# Altium schematic sheet SHDN-IMD-S06-V00-PSU.SchDoc: Power Supply
size A3; DrawnBy: Jonn Dillon; DocumentNumber: 4; Revision: 00; SheetNumber: 4; SheetTotal: 6; Version: 01; Project: IMD Daughter Board 2020; PageSetup: Record=PageOptions|CenterHorizontal=True|CenterVertical=True|PrintScale=0.97|XCorrection=1.00|YCorrection=1.00|PrintKind=0|BorderSize=5000000|LeftOffset=0|BottomOffset=0|Orientation=2|PaperLength=1000|PaperWidth=1000|Scale=100|PaperSource=7|PrintQuality=-4|MediaType=1|DitherType=10|PaperKind=A4|PrintScaleMode=1
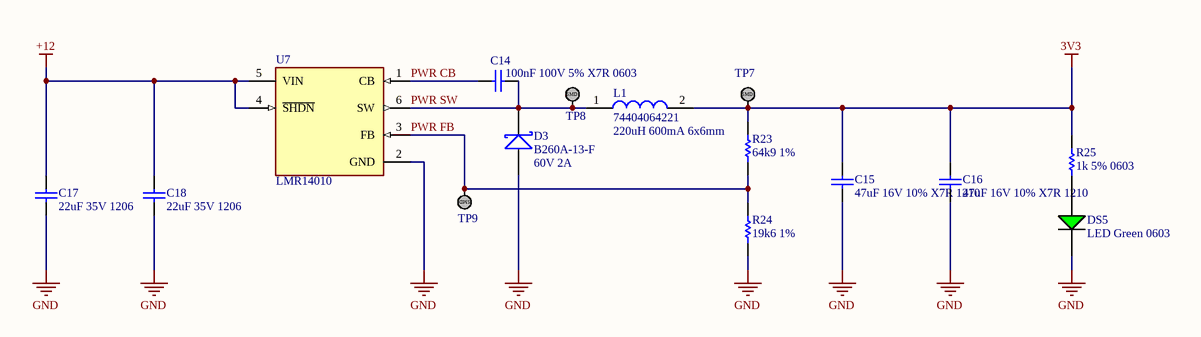
[diagram p0: SHDN-IMD-S06-V00-PSU.SchDoc]

## Parts
C14  100nF 100V 5% X7R 0603  [Cap_Ceramic_0603]
C15  47uF 16V 10% X7R 1210  [Cap_Ceramic_1210]
C16  47uF 16V 10% X7R 1210  [Cap_Ceramic_1210]
C17  22uF 35V 1206  [Cap_Ceramic_1206]
C18  22uF 35V 1206  [Cap_Ceramic_1206]
D3  B260A-13-F  [SMA]
DS5  LED Green 0603  [LED GREEN 0603]
L1  74404064221  [Inductor_6x6mm]
R23  64k9 1%  [Res_ThinFilm_0603]
R24  19k6 1%  [Res_ThinFilm_0603]
R25  1k 5% 0603  [Res_ThinFilm_0603]
TP7  TestPoint_SMD  [TestPointSMD]  (value not drawn)
TP8  TestPoint_SMD  [TestPointSMD]  (value not drawn)
TP9  TestPoint_SMD  [TestPointSMD]  (value not drawn)
U7  LMR14010  [LMR14010]

## Nets
3V3: C15.2 C16.2 L1.2 R23.2 R25.2 TP7.1
+12: C17.2 C18.2 U7.4(~{SHDN}) U7.5(VIN)
GND: C15.1 C16.1 C17.1 C18.1 D3.A DS5.2(C) R24.1 U7.2(GND)
PWR CB: C14.1 U7.1(CB)
PWR FB: R23.1 R24.2 TP9.1 U7.3(FB)
PWR SW: C14.2 D3.K L1.1 TP8.1 U7.6(SW)
NetDS5_1: DS5.1(A) R25.1

## Notes on the sheet
- (near L1) 220uH 600mA 6x6mm
- (near D3) 60V 2A
- Revision History:
- Sheet Title:
- Rev
- Date
- Description
- Project:
- Size:
- Drawn By:
- A3
- Number:
- Revision:
- Sheet
- Version:
- of
- QUT Motorsport
- O-120, Gardens Point
- 2 George Street
- Brisbane, QLD 4000
- Australia
- Print Date:
- Print Time:
- File Name:
- (in symbol TestPoint_SMD) SMD

## Library data of the parts
C14 = 100nF 100V 5% X7R 0603: Capacitor, Ceramic, SMD, 100nF, 100V, 5%, X7R, 0603
C15 C16 = 47uF 16V 10% X7R 1210: Capacitor, Ceramic, SMD, 47uF, 16V, 5%, X7R, 1210
C17 C18 = 22uF 35V 10% X7R 1206: Capacitor, Ceramic, SMD, 22uF, 35V, 10%, X7R, 1206
D3 = B260A-13-F: Diode, Schottky Barrier Rectifier, 60 V, 2 A, B260A-13-F
L1 = 74404064221: FIXED IND 220UH 660MA 850 MOHM; ComponentLink1Description: Digikey; ComponentLink1URL: https://www.digikey.com.au/product-detail/en/w%C3%BCrth-elektronik/74404064221/732-7261-1-ND/5353241; ComponentLink2Description: LCSC A; ComponentLink2URL: https://lcsc.com/product-detail/Power-Inductors_Sunlord-SWPA6045S221MT_C91047.html; ComponentLink3Description: LCSC B; ComponentLink3URL: https://lcsc.com/product-detail/Power-Inductors_SXN-Shun-Xiang-Nuo-Elec-SMNR6045-221MT_C467145.html
R23 = 64k9 1% 0603: Resistor, SMD, 64k9, 0.1W, 5%, 0603
R24 = 19k6 1% 0603: Resistor, SMD, 19k6, 0.1W, 5%, 0603
R25 = 1k 5% 0603: Resistor, SMD, 1k, 0.1W, 5%, 0603